# Altium schematic sheet mosfet.SchDoc
size Letter
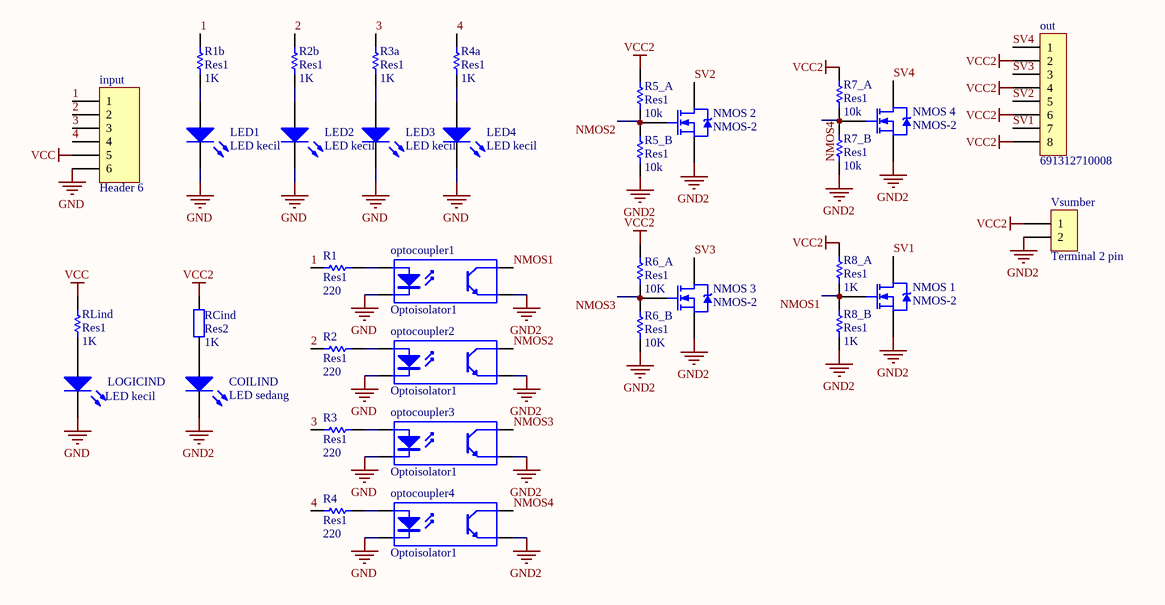
[diagram p0: mosfet.SchDoc]

## Parts
COILIND  LED sedang  [LED sedang]
input  Header 6  [HDR1X6]
LED1  LED kecil  [LED kecil]
LED2  LED kecil  [LED kecil]
LED3  LED kecil  [LED kecil]
LED4  LED kecil  [LED kecil]
LOGICIND  LED kecil  [LED sedang]
NMOS_1  NMOS-2  [SFM-T3/A4.7V]
NMOS_2  NMOS-2  [SFM-T3/A4.7V]
NMOS_3  NMOS-2  [SFM-T3/A4.7V]
NMOS_4  NMOS-2  [SFM-T3/A4.7V]
optocoupler1  Optoisolator1  [DIP-4]
optocoupler2  Optoisolator1  [DIP-4]
optocoupler3  Optoisolator1  [DIP-4]
optocoupler4  Optoisolator1  [DIP-4]
out  691312710008  [691312710008]
R1  Res1  value 220  [AXIAL-0.3]
R1b  Res1  value 1K  [AXIAL-0.3]
R2  Res1  value 220  [AXIAL-0.3]
R2b  Res1  value 1K  [AXIAL-0.3]
R3  Res1  value 220  [AXIAL-0.3]
R3a  Res1  value 1K  [AXIAL-0.3]
R4  Res1  value 220  [AXIAL-0.3]
R4a  Res1  value 1K  [AXIAL-0.3]
R5_A  Res1  value 10k  [AXIAL-0.3]
R5_B  Res1  value 10k  [AXIAL-0.3]
R6_A  Res1  value 10K  [AXIAL-0.3]
R6_B  Res1  value 10K  [AXIAL-0.3]
R7_A  Res1  value 10k  [AXIAL-0.3]
R7_B  Res1  value 10k  [AXIAL-0.3]
R8_A  Res1  value 1K  [AXIAL-0.3]
R8_B  Res1  value 1K  [AXIAL-0.3]
RCind  Res2  value 1K  [AXIAL-0.4]
RLind  Res1  value 1K  [AXIAL-0.3]
Vsumber  Terminal 2 pin  [691312710002]

## Nets
GND: input.6 LED1.2(K) LED2.2(K) LED3.2(K) LED4.2(K) LOGICIND.2(K) optocoupler1.2(K) optocoupler2.2(K) optocoupler3.2(K) optocoupler4.2(K)
GND2: COILIND.2(K) NMOS_1.3(S) NMOS_2.3(S) NMOS_3.3(S) NMOS_4.3(S) optocoupler1.3(E) optocoupler2.3(E) optocoupler3.3(E) optocoupler4.3(E) R5_B.1 R6_B.1 R7_B.1 R8_B.1 Vsumber.2
VCC: input.5 RLind.2
VCC2: out.2 out.4 out.6 out.8 R5_A.2 R6_A.2 R7_A.2 R8_A.2 RCind.2 Vsumber.1
1: input.1 R1.1 R1b.2
2: input.2 R2.1 R2b.2
3: input.3 R3.1 R3a.2
4: input.4 R4.1 R4a.2
NMOS1: NMOS_1.1(G) optocoupler1.4(C) R8_A.1 R8_B.2
NMOS2: NMOS_2.1(G) optocoupler2.4(C) R5_A.1 R5_B.2
NMOS3: NMOS_3.1(G) optocoupler3.4(C) R6_A.1 R6_B.2
NMOS4: NMOS_4.1(G) optocoupler4.4(C) R7_A.1 R7_B.2
SV1: NMOS_1.2(D) out.7
SV2: NMOS_2.2(D) out.5
SV3: NMOS_3.2(D) out.3
SV4: NMOS_4.2(D) out.1
NetCOILIND_1: COILIND.1(A) RCind.1
NetLED1_1: LED1.1(A) R1b.1
NetLED2_1: LED2.1(A) R2b.1
NetLED3_1: LED3.1(A) R3a.1
NetLED4_1: LED4.1(A) R4a.1
NetLOGICIND_1: LOGICIND.1(A) RLind.1
Netoptocoupler1_1: optocoupler1.1(A) R1.2
Netoptocoupler2_1: optocoupler2.1(A) R2.2
Netoptocoupler3_1: optocoupler3.1(A) R3.2
Netoptocoupler4_1: optocoupler4.1(A) R4.2

## Library data of the parts
input = Header 6: Header, 6-Pin; LatestRevisionDate: 17-Jul-2002; LatestRevisionNote: Re-released for DXP Platform.; Publisher: Altium Limited
LOGICIND = LED sedang
NMOS_1-NMOS_4 = NMOS-2: N-Channel Power MOSFET; Note: Pin 2 is electrically connected to pin 4.; Published: 8-Jun-2000; LatestRevisionDate: 17-Jul-2002; LatestRevisionNote: Re-released for DXP Platform.; DatasheetVersion: PD-9.814; PackageReference: TO-220AB; Publisher: Altium Limited; Code_JEDEC: TO-220-AB; ComponentLink1Description: Manufacturer Link; ComponentLink1URL: http://www.irf.com/
optocoupler1-optocoupler4 = Optoisolator1: 4-Pin Phototransistor Optocoupler; Published: 24-Mar-1999; LatestRevisionDate: 04-Mar-2005; LatestRevisionNote: Sch pins 3 & 4 Swapped.; DatasheetVersion: Nov-2003; PackageReference: DIP-4; Publisher: Altium Limited
out = 691312710008: WR-TBL Terminal block - serie 3127 - 5.00mm; Manufacturer: Würth Elektronik eiSos GmbH; ComponentLink1 Description: Manufacturer; ComponentLink2 Description: Datasheet; NoPins: 08; Created Date: 6 January 2014; partNo: 691312710008; ComponentLink1URL: http://www.we-online.com; ComponentLink2URL: http://katalog.we-online.de/em/datasheet/6913127100xx.pdf; Created by: Karrer Zheng
R1 R1b R2 R2b R3 R3a R4 R4a R5_A R5_B R6_A R6_B R7_A R7_B R8_A R8_B RLind = Res1: Resistor; Published: 8-Jun-2000; LatestRevisionDate: 17-Jul-2002; LatestRevisionNote: Re-released for DXP Platform.; PackageReference: AXIAL-0.3; Publisher: Altium Limited
RCind = Res2: Resistor; Published: 8-Jun-2000; LatestRevisionDate: 17-Jul-2002; LatestRevisionNote: Re-released for DXP Platform.; PackageReference: AXIAL-0.4; Publisher: Altium Limited
Vsumber = 691312710002: WR-TBL Terminal block - serie 3127 - 5.00mm; Manufacturer: Würth Elektronik eiSos GmbH; ComponentLink1 Description: Manufacturer; ComponentLink2 Description: Datasheet; NoPins: 02; Created Date: 6 January 2014; partNo: 691312710002; ComponentLink1URL: http://www.we-online.com; ComponentLink2URL: http://katalog.we-online.de/em/datasheet/6913127100xx.pdf; Created by: Karrer Zheng